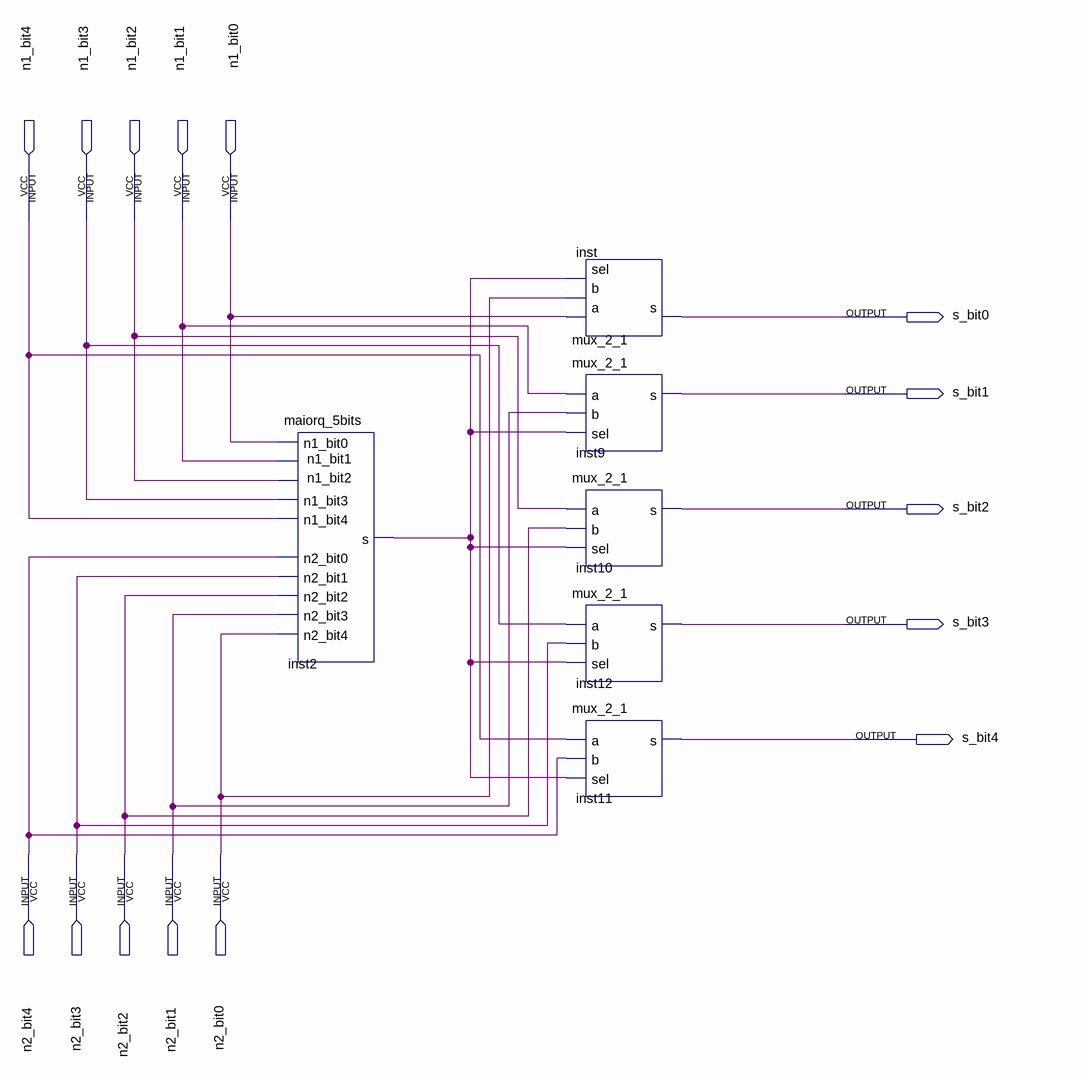
[diagram p0: schematic sheet]
// Quartus schematic min.bdf as structural Verilog: 6 symbols, 15 pins
module min (
  input  n1_bit4,
  input  n1_bit3,
  input  n1_bit2,
  input  n1_bit1,
  input  n1_bit0,
  input  n2_bit4,
  input  n2_bit3,
  input  n2_bit2,
  input  n2_bit1,
  input  n2_bit0,
  output s_bit0,
  output s_bit1,
  output s_bit2,
  output s_bit3,
  output s_bit4
);

  wire inst2_s;

  maiorq_5bits inst2 (
    .n1_bit4(n1_bit4), .n1_bit2(n1_bit2), .n1_bit0(n1_bit0), .n1_bit1(n1_bit1), .n1_bit3(n1_bit3),
    .n2_bit0(n2_bit4), .n2_bit1(n2_bit3), .n2_bit3(n2_bit1), .n2_bit2(n2_bit2), .n2_bit4(n2_bit0), .s(inst2_s));
  mux_2_1 inst (.a(n1_bit0), .b(n2_bit0), .sel(inst2_s), .s(s_bit0));
  mux_2_1 inst9 (.a(n1_bit1), .b(n2_bit1), .sel(inst2_s), .s(s_bit1));
  mux_2_1 inst10 (.a(n1_bit2), .b(n2_bit2), .sel(inst2_s), .s(s_bit2));
  mux_2_1 inst12 (.a(n1_bit3), .b(n2_bit3), .sel(inst2_s), .s(s_bit3));
  mux_2_1 inst11 (.a(n1_bit4), .b(n2_bit4), .sel(inst2_s), .s(s_bit4));
endmodule
